# EAGLE design 3 Stepper Shield (EAGLE 9.6.2)
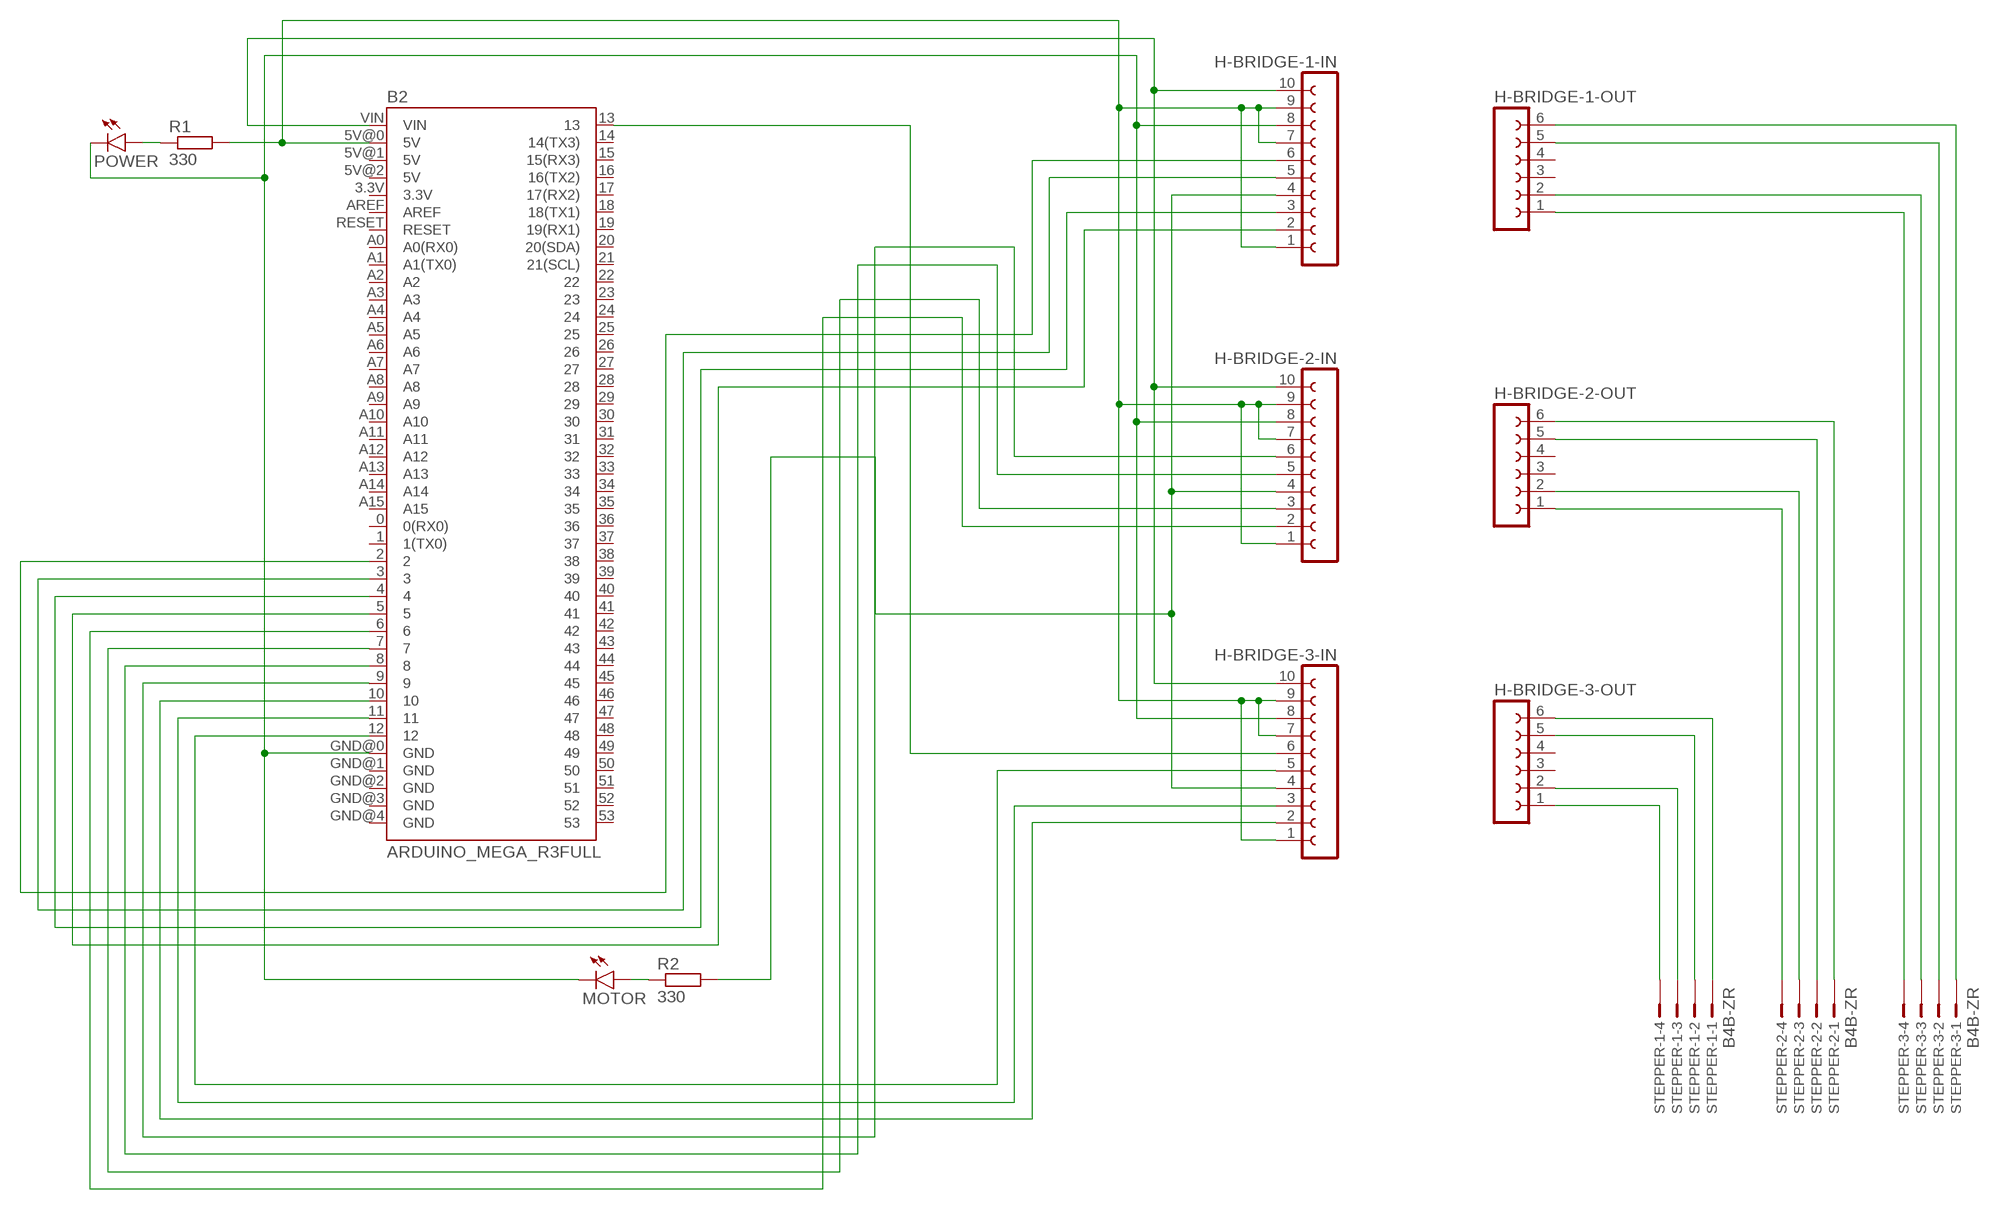
[diagram p0: schematic, sheet 1]

## Parts
B2  ARDUINO_MEGA_R3FULL  [ARDUINO_MEGA]
H-BRIDGE-1-IN  FE10-1  [FE10]
H-BRIDGE-1-OUT  FE06-1  [FE06]
H-BRIDGE-2-IN  FE10-1  [FE10]
H-BRIDGE-2-OUT  FE06-1  [FE06]
H-BRIDGE-3-IN  FE10-1  [FE10]
H-BRIDGE-3-OUT  FE06-1  [FE06]
MOTOR  LED5MM  [LED5MM]
POWER  LED5MM  [LED5MM]
R1  330  R-EU_0207/10  [0207/10]
R2  330  R-EU_0207/10  [0207/10]
STEPPER-1  B4B-ZR  [B4B-ZR]
STEPPER-2  B4B-ZR  [B4B-ZR]
STEPPER-3  B4B-ZR  [B4B-ZR]

## Nets
N$1: B2.5 H-BRIDGE-1-IN.2
N$2: B2.4 H-BRIDGE-1-IN.3
N$3: B2.3 H-BRIDGE-1-IN.5
N$4: B2.2 H-BRIDGE-1-IN.6
N$5: B2.9 H-BRIDGE-2-IN.6
N$6: B2.8 H-BRIDGE-2-IN.5
N$7: B2.7 H-BRIDGE-2-IN.3
N$8: B2.6 H-BRIDGE-2-IN.2
N$9: B2.13 H-BRIDGE-3-IN.6
N$10: B2.12 H-BRIDGE-3-IN.5
N$11: B2.11 H-BRIDGE-3-IN.3
N$12: B2.10 H-BRIDGE-3-IN.2
N$13 [Power]: B2.VIN H-BRIDGE-1-IN.10 H-BRIDGE-2-IN.10 H-BRIDGE-3-IN.10
N$14 [Power]: B2.GND@0(GND) H-BRIDGE-1-IN.8 H-BRIDGE-2-IN.8 H-BRIDGE-3-IN.8 MOTOR.K(C) POWER.K(C)
N$15 [Power]: B2.5V@0(5V) H-BRIDGE-1-IN.1 H-BRIDGE-1-IN.7 H-BRIDGE-1-IN.9 H-BRIDGE-2-IN.1 H-BRIDGE-2-IN.7 H-BRIDGE-2-IN.9 H-BRIDGE-3-IN.1 H-BRIDGE-3-IN.7 H-BRIDGE-3-IN.9 R1.2
N$16: MOTOR.A R2.1
N$17: H-BRIDGE-1-IN.4 H-BRIDGE-2-IN.4 H-BRIDGE-3-IN.4 R2.2
N$18 [Power]: H-BRIDGE-3-OUT.6 STEPPER-1.1
N$19 [Power]: H-BRIDGE-3-OUT.5 STEPPER-1.2
N$20 [Power]: H-BRIDGE-3-OUT.2 STEPPER-1.3
N$21 [Power]: H-BRIDGE-3-OUT.1 STEPPER-1.4
N$22 [Power]: H-BRIDGE-2-OUT.1 STEPPER-2.4
N$23 [Power]: H-BRIDGE-2-OUT.2 STEPPER-2.3
N$24 [Power]: H-BRIDGE-2-OUT.5 STEPPER-2.2
N$25 [Power]: H-BRIDGE-2-OUT.6 STEPPER-2.1
N$26 [Power]: H-BRIDGE-1-OUT.1 STEPPER-3.4
N$27 [Power]: H-BRIDGE-1-OUT.2 STEPPER-3.3
N$28 [Power]: H-BRIDGE-1-OUT.5 STEPPER-3.2
N$29 [Power]: H-BRIDGE-1-OUT.6 STEPPER-3.1
N$30: POWER.A R1.1
Unconnected: B2.0(0(RX0)) B2.1(1(TX0)) B2.3.3V B2.5V@1(5V) B2.5V@2(5V) B2.14(14(TX3)) B2.15(15(RX3)) B2.16(16(TX2)) B2.17(17(RX2)) B2.18(18(TX1)) B2.19(19(RX1)) B2.20(20(SDA)) B2.21(21(SCL)) B2.22 B2.23 B2.24 B2.25 B2.26 B2.27 B2.28 B2.29 B2.30 B2.31 B2.32 B2.33 B2.34 B2.35 B2.36 B2.37 B2.38 B2.39 B2.40 B2.41 B2.42 B2.43 B2.44 B2.45 B2.46 B2.47 B2.48 B2.49 B2.50 B2.51 B2.52 B2.53 B2.A0(A0(RX0)) B2.A1(A1(TX0)) B2.A2 B2.A3 B2.A4 B2.A5 B2.A6 B2.A7 B2.A8 B2.A9 B2.A10 B2.A11 B2.A12 B2.A13 B2.A14 B2.A15 B2.AREF B2.GND@1(GND) B2.GND@2(GND) B2.GND@3(GND) B2.GND@4(GND) B2.RESET H-BRIDGE-1-OUT.3 H-BRIDGE-1-OUT.4 H-BRIDGE-2-OUT.3 H-BRIDGE-2-OUT.4 H-BRIDGE-3-OUT.3 H-BRIDGE-3-OUT.4

## Library data of the parts
B2 = SparkFun-Boards:ARDUINO_MEGA_R3: Arduino Mega R3 ATmega2560 R3 compatible footprint. SparkFun Products: Arduino Mega 2560 R3 <https://www.sparkfun.com/products/11061>
H-BRIDGE-1-IN H-BRIDGE-2-IN H-BRIDGE-3-IN = con-lsta:FE10-1: FEMALE HEADER; OC_FARNELL: unknown; OC_NEWARK: unknown
H-BRIDGE-1-OUT H-BRIDGE-2-OUT H-BRIDGE-3-OUT = con-lsta:FE06-1: FEMALE HEADER; OC_FARNELL: unknown; OC_NEWARK: unknown
MOTOR POWER = led:LED: LED OSRAM: - CHIPLED LG R971, LG N971, LY N971, LG Q971, LY Q971, LO R971, LY R971 LH N974, LH R974 LS Q976, LO Q976, LY Q976 LO Q996 - Hyper CHIPLED LW Q18S LB Q993, LB Q99A, LB R99A - SideLED LS A670, LO A670, LY A670, LG A670, LP A670 LB A673, LV A673, LT A673, LW A673 LH A674 LY A675 LS A676, LA A676, LO A676, LY A676, LW A676 LS A679, LY A679, LG A679 - Hyper Micro SIDELED® LS Y876, LA Y876, LO Y876, LY Y876 LT Y87S - SmartLED LW L88C, LW L88S LB L89C, LB L89S, LG L890 LS L89K, LO L89K, LY L89K LS L896, LA L896, LO L896, LY L896 - TOPLED LS T670, LO T670, LY T670, LG T670, LP T670 LSG T670, LSP T670, LSY T670, LOP T670, LYG T670 LG T671, LOG T671, LSG T671 LB T673, LV T673, LT T673, LW T673 LH T674 LS T676, LA T676, LO T676, LY T676, LB T676, LH T676, LSB T676, LW T676 LB T67C, LV T67C, LT T67C, LS T67K, LO T67K, LY T67K, LW E67C LS E67B, LA E67B, LO E67B, LY E67B, LB E67C, LV E67C, LT E67C LW T67C LS T679, LY T679, LG T679 LS T770, LO T770, LY T770, LG T770, LP T770 LB T773, LV T773, LT T773, LW T773 LH T774 LS E675, LA E675, LY E675, LS T675 LS T776, LA T776, LO T776, LY T776, LB T776 LHGB T686 LT T68C, LB T68C - Hyper Mini TOPLED® LB M676 - Mini TOPLED Santana® LG M470 LS M47K, LO M47K, LY M47K Source: http://www.osram.convergy.de LUXEON: - LUMILED® LXK2-PW12-R00, LXK2-PW12-S00, LXK2-PW14-U00, LXK2-PW14-V00 LXK2-PM12-R00, LXK2-PM12-S00, LXK2-PM14-U00 LXK2-PE12-Q00, LXK2-PE12-R00, LXK2-PE12-S00, LXK2-PE14-T00, LXK2-PE14-U00 LXK2-PB12-K00, LXK2-PB12-L00, LXK2-PB12-M00, LXK2-PB14-N00, LXK2-PB14-P00, LXK2-PB14-Q00 LXK2-PR12-L00, LXK2-PR12-M00, LXK2-PR14-Q00, LXK2-PR14-R00 LXK2-PD12-Q00, LXK2-PD12-R00, LXK2-PD12-S00 LXK2-PH12-R00, LXK2-PH12-S00 LXK2-PL12-P00, LXK2-PL12-Q00, LXK2-PL12-R00 Source: www.luxeon.com KINGBRIGHT: KA-3528ASYC Source: www.kingbright.com
R1 R2 = rcl:R-EU_: RESISTOR, European symbol; SPICEPREFIX: R
STEPPER-1-STEPPER-3 = con-jst:?4B-ZR: ZH CONNECTOR 1.5 mm, 4 pin 1 row Source: http://www.jst.com .. eZH.pdf; MF: FARNELL; MPN: B4B-ZR(LF)(SN); OC_FARNELL: 1830916; OC_NEWARK: 37K9960

## Net classes
0 default: width 0.178 mm
1 Power: width 0.508 mm

## Board
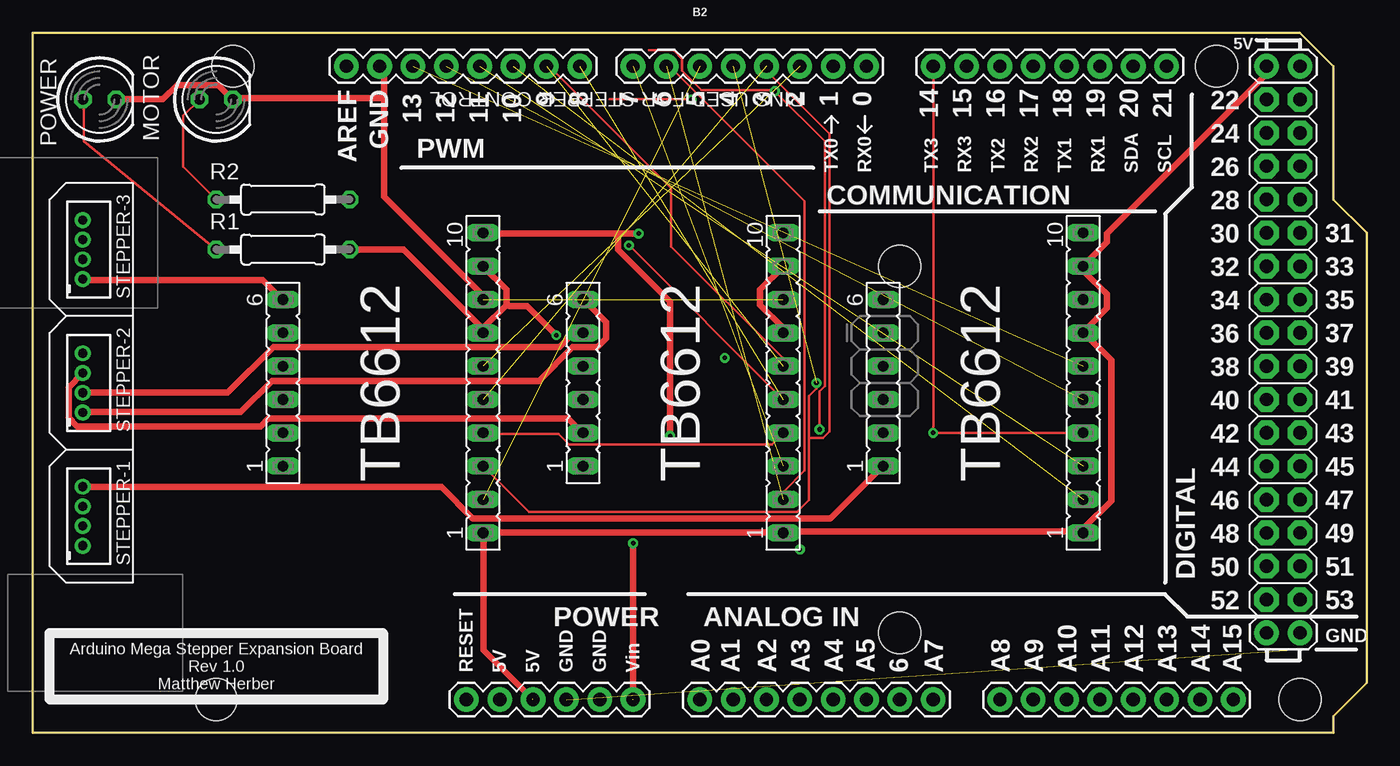
[diagram p1: board, top side]
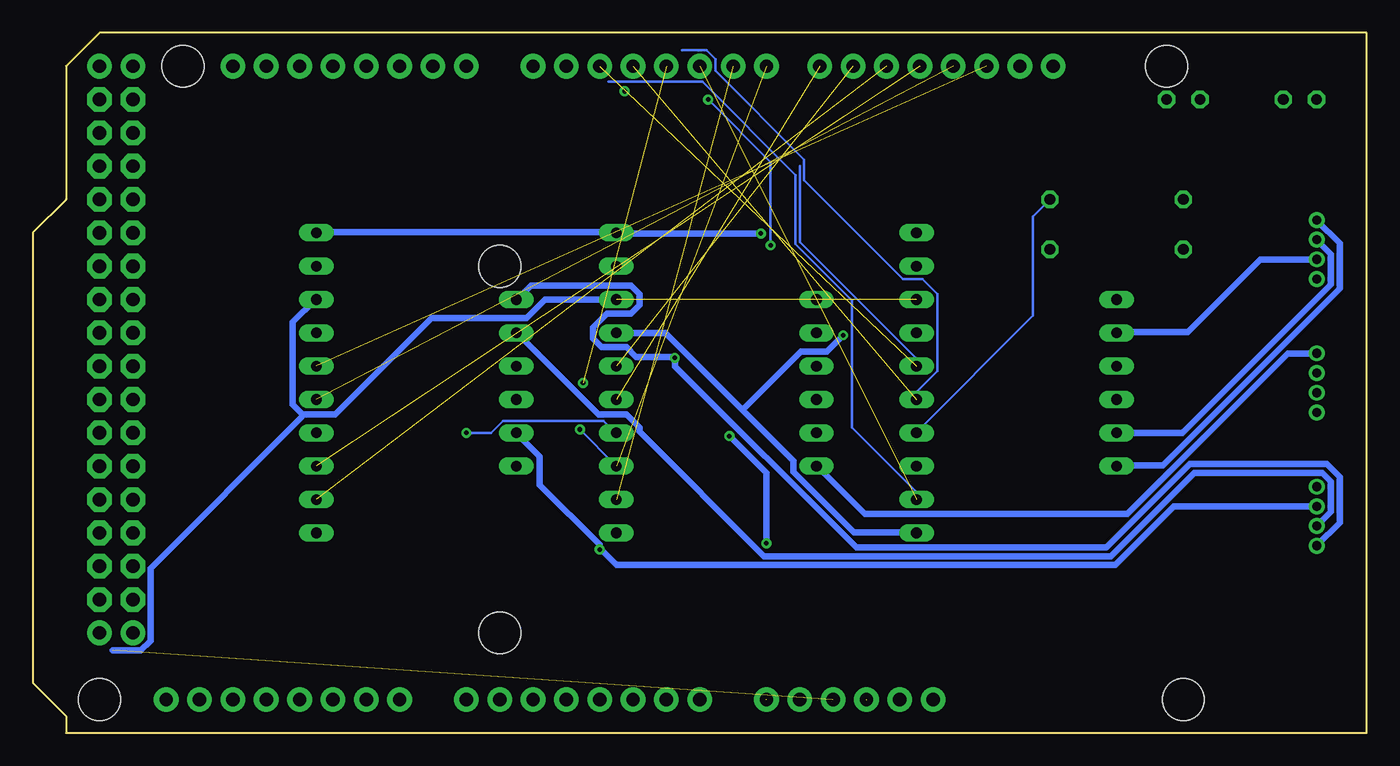
[diagram p2: board, bottom side, seen from below]

Size 101.6 x 53.34 mm. Coordinates in mm from the lower left corner, seen from the top.
Outline: 0,0 0,53.34 96.52,53.34 99.06,50.8 99.06,40.64 101.6,38.1 101.6,3.81 99.06,1.27 99.06,0 0,0
Copper layers (1*16): Top 0.035mm / dielectric 1.5mm / Bottom 0.035mm
Design rules "default": minimum track width 6mil, minimum drill 0.35mm, track to track 6mil, track to pad 6mil, pad to pad 6mil, via to via 6mil, smd to smd 6mil, copper to edge 40mil, drill to drill 6mil, minimum pad ring 10mil, minimum via ring 8mil, stop-mask expansion 4mil, vias tented up to drill 0mil, thermal gap 10mil

### Footprints (pad centres in the part's own frame; a part is rotated, then mirrored left to right if it is on the bottom)
ARDUINO_MEGA = drill 1.016 pad 1.88: 0 13.97,24.13; 1 11.43,24.13; 2 8.89,24.13; 3 6.35,24.13; 3.3V -13.97,-24.13; 4 3.81,24.13; 5 1.27,24.13; 5V@0 -11.43,-24.13; 5V@1 44.45,24.13; 5V@2 46.99,24.13; 6 -1.27,24.13; 7 -3.81,24.13; 8 -7.874,24.13; 9 -10.414,24.13; 10 -12.954,24.13; 11 -15.494,24.13; 12 -18.034,24.13; 13 -20.574,24.13; 14 19.05,24.13; 15 21.59,24.13; 16 24.13,24.13; 17 26.67,24.13; 18 29.21,24.13; 19 31.75,24.13; 20 34.29,24.13; 21 36.83,24.13; A0 1.27,-24.13; A1 3.81,-24.13; A2 6.35,-24.13; A3 8.89,-24.13; A4 11.43,-24.13; A5 13.97,-24.13; A6 16.51,-24.13; A7 19.05,-24.13; A8 24.13,-24.13; A9 26.67,-24.13; A10 29.21,-24.13; A11 31.75,-24.13; A12 34.29,-24.13; A13 36.83,-24.13; A14 39.37,-24.13; A15 41.91,-24.13; AREF -25.654,24.13; GND@0 -8.89,-24.13; GND@1 -6.35,-24.13; GND@2 44.45,-19.05; GND@3 46.99,-19.05; GND@4 -23.114,24.13; RESET -16.51,-24.13; VIN -3.81,-24.13 | drill 1.016 pad 1.88 octagon: 22 44.45,21.59; 23 46.99,21.59; 24 44.45,19.05; 25 46.99,19.05; 26 44.45,16.51; 27 46.99,16.51; 28 44.45,13.97; 29 46.99,13.97; 30 44.45,11.43; 31 46.99,11.43; 32 44.45,8.89; 33 46.99,8.89; 34 44.45,6.35; 35 46.99,6.35; 36 44.45,3.81; 37 46.99,3.81; 38 44.45,1.27; 39 46.99,1.27; 40 44.45,-1.27; 41 46.99,-1.27; 42 44.45,-3.81; 43 46.99,-3.81; 44 44.45,-6.35; 45 46.99,-6.35; 46 44.45,-8.89; 47 46.99,-8.89; 48 44.45,-11.43; 49 46.99,-11.43; 50 44.45,-13.97; 51 46.99,-13.97; 52 44.45,-16.51; 53 46.99,-16.51 | hole 3.2: -34.29,24.13; -35.56,-24.13; 16.51,8.89; 16.51,-19.05; 40.64,24.13; 46.99,-24.13
FE10 = drill 0.813 long: 1 -11.43,0; 2 -8.89,0; 3 -6.35,0; 4 -3.81,0; 5 -1.27,0; 6 1.27,0; 7 3.81,0; 8 6.35,0; 9 8.89,0; 10 11.43,0
FE06 = drill 0.813 long: 1 -6.35,0; 2 -3.81,0; 3 -1.27,0; 4 1.27,0; 5 3.81,0; 6 6.35,0
LED5MM = drill 0.813 octagon: A -1.27,0; K 1.27,0
0207/10 = drill 0.813 octagon: 1 -5.08,0; 2 5.08,0
B4B-ZR = drill 0.7 pad 1.1: 1 -2.25,0; 2 -0.75,0; 3 0.75,0; 4 2.25,0

### Placement (x,y rotation side)
B2  49.53,26.67 0 top
H-BRIDGE-1-IN  34.29,26.67 90 top
H-BRIDGE-1-OUT  19.05,26.67 90 top
H-BRIDGE-2-IN  57.15,26.67 90 top
H-BRIDGE-2-OUT  41.91,26.67 90 top
H-BRIDGE-3-IN  80.01,26.67 90 top
H-BRIDGE-3-OUT  64.77,26.67 90 top
MOTOR  13.97,48.26 0 top
POWER  5.08,48.26 0 top
R1  19.05,36.83 0 top
R2  19.05,40.64 0 top
STEPPER-1  3.81,16.51 90 top
STEPPER-2  3.81,26.67 90 top
STEPPER-3  3.81,36.83 90 top

### Tracks (layer width: path | path; a pad name or v marks a point on that pad's centre or on a via)
N$1  (1 unrouted)
  Bottom 0.178: 57.76,49.61 50.6,49.61 43.5,42.51 43.5,37.23 39.21,32.94 39.21,23.28 34.34,18.41 34.34,17.83 H-BRIDGE-1-IN.2
N$2  (via drill 0.35)  (1 unrouted)
  Top 0.178: 59.11,22.45 59.11,17.75 58.2,16.84 37.81,16.84 34.34,20.31 H-BRIDGE-1-IN.3 | 59.11,22.45 59.11,25.67 59.68,26.25 v59.68,26.66 v59.69,26.67 | 55.89,50.77 55.89,50.44 60.67,45.65 60.67,22.95 60.18,22.45 59.11,22.45
N$3  (1 unrouted)
  Bottom 0.178: H-BRIDGE-1-IN.5 34.26,25.43 34.26,26 32.69,27.57 32.69,33.43 33.85,34.59 35.33,34.59 42.84,42.1 42.84,43.67 49.61,50.44 49.61,51.35 50.27,52.01 52.13,52.01
N$4  (1 unrouted)
  Bottom 0.178: 43.17,43.17 43.17,37.4 34.34,28.56 34.34,27.98 H-BRIDGE-1-IN.6
N$5  (1 unrouted)
  Top 0.178: 39.38,50.77 48.62,41.52 48.62,37.06 57.12,28.56 57.12,27.98 H-BRIDGE-2-IN.6
N$6  (via drill 0.35)  (1 unrouted)
  Top 0.178: 43.92,48.29 50.11,48.29 v50.16,48.26 | v45.4,37.15 H-BRIDGE-2-IN.5
  Bottom 0.178: v45.4,37.15 45.4,43.5 50.11,48.21 v50.16,48.26
N$7  (via drill 0.35)  (1 unrouted)
  Top 0.178: 46.93,52.01 48.79,52.01 49.45,51.35 49.45,50.44 50.93,48.95 56.46,48.95 v56.52,48.9 56.55,48.87 60.34,45.07 60.34,26.42 59.93,26 v59.93,23.11
  Bottom 0.178: v59.93,23.11 57.21,20.39 H-BRIDGE-2-IN.3
N$8  (1 unrouted)
  Top 0.178: H-BRIDGE-2-IN.2 57.21,17.83 57.21,18.41 58.78,19.98 58.78,40.53 48.51,50.8
N$9  (1 unrouted)
N$10  (1 unrouted)
N$11  (1 unrouted)
N$12  (1 unrouted)
N$13  (via drill 0.35)  (1 unrouted)
  Top 0.508: v46.15,38.06 44.58,38.06 | 44.58,38.06 34.34,38.06 H-BRIDGE-1-IN.10 | v45.73,14.45 45.73,2.56 | v48.54,22.62 48.54,32.85 44.58,36.82 44.58,38.06
  Bottom 0.508: v46.15,38.06 57.12,38.06 H-BRIDGE-2-IN.10 57.37,38.14 79.99,38.14 H-BRIDGE-3-IN.10 | v45.73,14.45 45.73,19.81 v48.54,22.62
N$14  (2 unrouted)
  Top 0.508: POWER.K 6.36,48.29 9.91,48.29 10.98,49.37 14.13,49.37 MOTOR.K 15.47,48.37 26.75,48.37 | 26.75,50.77 26.75,48.37 | 26.75,48.37 26.75,40.86 34.26,33.35 34.26,33.02 H-BRIDGE-1-IN.8
  Bottom 0.508: H-BRIDGE-2-IN.8 62.57,33.02 63.98,31.62 71.24,31.62 78.59,24.27 81.06,24.27 | 81.06,24.27 81.81,25.01 81.81,31.29 80.07,33.02 H-BRIDGE-3-IN.8 | 95.51,6.27 93.36,6.27 92.62,7.02 92.62,12.55 81.15,24.02 81.06,24.27
N$15  (via drill 0.35)  (1 unrouted)
  Top 0.508: 93.86,50.6 93.86,50.11 81.81,38.06 81.81,37.4 80.16,35.74 H-BRIDGE-3-IN.9 80.07,35.5 80.07,35.17 81.81,33.43 81.81,32.36 80.16,30.71 H-BRIDGE-3-IN.7 80.07,30.46 82.14,28.4 82.14,17.67 80.07,15.6 80.07,15.27 H-BRIDGE-3-IN.1 79.83,15.35 57.37,15.35 H-BRIDGE-2-IN.1 57.12,15.27 34.59,15.27 H-BRIDGE-1-IN.1 34.34,15.19 34.34,6.27 38.06,2.56 | 36.07,32.61 34.34,30.87 34.34,30.54 H-BRIDGE-1-IN.7 34.09,30.96 28.23,36.82 24.15,36.82 R1.2 | 36.07,32.61 36.07,33.76 34.34,35.5 H-BRIDGE-1-IN.9 | H-BRIDGE-2-IN.7 57.12,30.54 57.12,30.87 55.39,32.61 55.39,33.76 57.12,35.5 H-BRIDGE-2-IN.9 | v39.87,30.3 37.64,32.52 36.32,32.52 36.07,32.61
  Bottom 0.508: 47.55,24.6 43.67,20.72 43.67,19.89 39.05,15.27 34.34,15.27 H-BRIDGE-1-IN.1 | 47.55,24.6 53.41,30.46 57.12,30.46 H-BRIDGE-2-IN.7 | v39.87,30.3 41.11,29.06 43.09,29.06 47.55,24.6
N$16
  Top 0.178: MOTOR.A 11.46,47.02 11.46,43.15 R2.1
N$17  (via drill 0.35)
  Top 0.178: H-BRIDGE-3-IN.4 79.99,22.87 68.6,22.87 v68.58,22.86 68.6,22.95 68.6,50.77 | H-BRIDGE-1-IN.4 34.34,22.78 40.04,22.78 40.86,21.96 56.3,21.96 57.12,22.78 H-BRIDGE-2-IN.4
  Bottom 0.178: R2.2 25.42,39.35 25.42,31.79 34.34,22.87 H-BRIDGE-1-IN.4 | v68.58,22.86 68.52,22.87 66.7,22.87 65.79,23.77 58.12,23.77 57.21,22.87 H-BRIDGE-2-IN.4
N$18  (via drill 0.35)
  Bottom 0.508: H-BRIDGE-3-OUT.6 64.72,33.02 63.65,34.09 56.05,34.09 55.39,33.43 55.39,32.61 56.05,31.95 57.87,31.95 58.94,30.87 58.94,30.05 58.28,29.39 56.38,29.39 55.64,28.64 52.75,28.64 v52.7,28.57 52.67,28.32 52.67,27.9 38.88,14.12 19.81,14.12 13.46,20.47 3.05,20.47 2.06,19.48 2.06,16.02 3.8,14.28 STEPPER-1.1
N$19
  Bottom 0.508: STEPPER-1.2 3.8,15.77 2.72,16.84 2.72,19.15 3.38,19.81 13.12,19.81 19.48,13.46 45.9,13.46 55.39,22.95 55.39,23.28 56.38,24.27 58.53,24.27 64.72,30.46 H-BRIDGE-3-OUT.5
N$20  (via drill 0.35)
  Bottom 0.508: H-BRIDGE-3-OUT.2 64.72,22.78 62.99,21.05 62.99,18.9 58.45,14.36 58.45,14.03 v58.42,13.97 58.2,13.87 57.12,12.79 19.15,12.79 14.69,17.25 3.88,17.25 STEPPER-1.3
N$21
  Top 0.508: STEPPER-1.4 3.88,18.74 31.12,18.74 33.52,16.34 60.76,16.34 64.72,20.31 H-BRIDGE-3-OUT.1
N$22
  Bottom 0.508: STEPPER-2.4 3.88,28.89 6.03,28.89 18.24,16.68 38.22,16.68 41.85,20.31 H-BRIDGE-2-OUT.1
N$23
  Top 0.508: STEPPER-2.3 3.8,27.41 2.72,26.33 2.72,24.02 3.38,23.36 17.34,23.36 17.91,23.94 40.78,23.94 41.85,22.87 H-BRIDGE-2-OUT.2
N$24
  Top 0.508: STEPPER-2.2 3.88,25.92 14.86,25.92 18.33,29.39 40.12,29.39 41.19,30.46 41.85,30.46 H-BRIDGE-2-OUT.5
N$25
  Top 0.508: STEPPER-2.1 3.88,24.43 15.85,24.43 18.24,26.83 38.55,26.83 41.11,29.39 43.01,29.39 43.67,30.05 43.67,31.29 41.94,33.02 H-BRIDGE-2-OUT.6
N$26
  Bottom 0.508: STEPPER-3.4 3.8,39.05 2.06,37.31 2.06,33.85 15.52,20.39 18.99,20.39 H-BRIDGE-1-OUT.1
N$27
  Bottom 0.508: STEPPER-3.3 3.8,37.56 2.72,36.49 2.72,34.18 14.03,22.87 18.99,22.87 H-BRIDGE-1-OUT.2
N$28
  Bottom 0.508: STEPPER-3.2 3.88,36.07 8.09,36.07 13.62,30.54 18.99,30.54 H-BRIDGE-1-OUT.5
N$29
  Top 0.508: STEPPER-3.1 3.88,34.51 17.5,34.51 18.99,33.02 H-BRIDGE-1-OUT.6
N$30
  Top 0.178: POWER.A 3.88,48.21 3.88,45.09 R1.1

### Text on the board
tNames: PINS USED FOR STEPPER CONTROL | TB6612 | TB6612 | TB6612 | Arduino Mega Stepper Expansion Board / Rev 1.0 / Matthew Herber